# Altium schematic sheet Gyroscope.SchDoc
size A; SheetNumber: 17; SheetTotal: 17
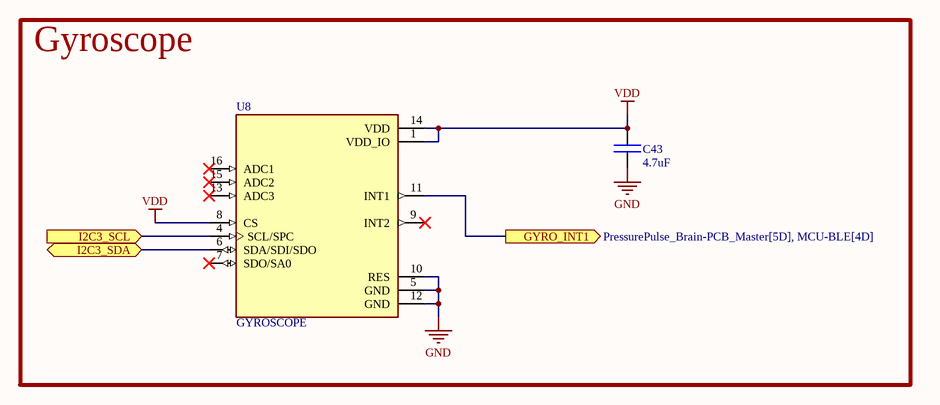
[diagram p0: Gyroscope.SchDoc]

## Parts
C43  value 4.7uF  [0402C]  (hidden comment: CAP)
U8  GYROSCOPE  [16-VFLGA]

## Blocks framed on the sheet
Gyroscope: C43 U8

## Ports
GYRO_INT1 (out, see PressurePulse_Brain-PCB_Master[5D], MCU-BLE[4D]), I2C3_SCL (in, see PressurePulse_Brain-PCB_Master[5D], Flow-Sensor[2C], Fuel-Gauge[4B], MCU-BLE[2D], Pressure-Sensor[1C]), I2C3_SDA (bidir, see PressurePulse_Brain-PCB_Master[5D], Flow-Sensor[3C], Fuel-Gauge[4B], MCU-BLE[2D], Pressure-Sensor[3C])

## Nets
GND: C43.1 U8.5(GND) U8.10(RES) U8.12(GND)
VDD: C43.2 U8.1(VDD_IO) U8.8(CS) U8.14(VDD)
GYRO_INT1: U8.11(INT1) ; port GYRO_INT1
I2C3_SCL: U8.4(SCL/SPC) ; port I2C3_SCL
I2C3_SDA: U8.6(SDA/SDI/SDO) ; port I2C3_SDA

Not connected (* = marked no-connect by the designer): U8 7(SDO/SA0)* 9(INT2)* 13(ADC3)* 15(ADC2)* 16(ADC1)*

## Library data of the parts
C43 = CAP: Capacitor; MFR: *; MFR PN: *; JLCPCB PN: *; Footprint: *
U8 = GYROSCOPE: Accelerometer X, Y, Z Axis Â±2g, 4g, 8g, 16g 0.5Hz ~ 625Hz 16-LGA (3x3); MFR: STMicroelectronics; Value: LIS3DHTR; MFR PN: LIS3DHTR; JLCPCB PN: C15134